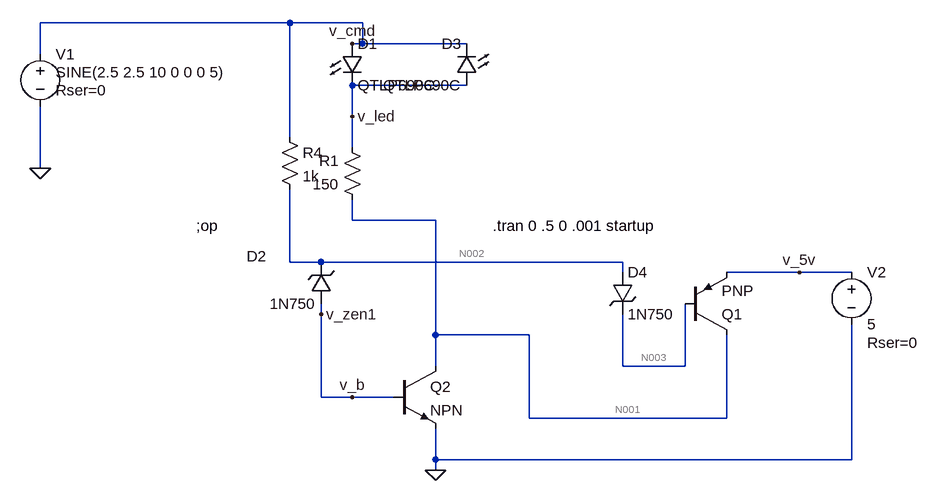
[diagram p0: schematic LedBicolore3Etats1Fil.asc]
LedBicolore3Etats1Fil.asc, the LTspice schematic file:
Version 4
SHEET 1 1060 680
WIRE 80 -32 -304 -32
WIRE 192 -32 80 -32
WIRE 192 0 192 -32
WIRE 192 0 176 0
WIRE 352 0 192 0
WIRE -304 16 -304 -32
WIRE 352 64 176 64
WIRE 176 112 176 64
WIRE 80 144 80 -32
WIRE 176 160 176 112
WIRE -304 192 -304 96
WIRE 176 272 176 240
WIRE 304 272 176 272
WIRE 80 336 80 224
WIRE 128 336 80 336
WIRE 592 336 128 336
WIRE 592 352 592 336
WIRE 864 352 752 352
WIRE 944 352 864 352
WIRE 128 416 128 400
WIRE 304 448 304 272
WIRE 448 448 304 448
WIRE 304 496 304 448
WIRE 592 496 592 416
WIRE 688 496 688 400
WIRE 688 496 592 496
WIRE 128 544 128 416
WIRE 176 544 128 544
WIRE 240 544 176 544
WIRE 448 576 448 448
WIRE 752 576 752 448
WIRE 752 576 448 576
WIRE 304 640 304 592
WIRE 944 640 944 432
WIRE 944 640 304 640
WIRE 304 656 304 640
FLAG 304 656 0
FLAG 176 0 v_cmd
FLAG 128 416 v_zen1
FLAG 176 544 v_b
FLAG -304 192 0
FLAG 176 112 v_led
FLAG 864 352 v_5v
SYMBOL res 192 256 R180
WINDOW 0 36 76 Left 2
WINDOW 3 36 40 Left 2
SYMATTR InstName R1
SYMATTR Value 150
SYMATTR SpiceLine tol=1 pwr=0.1
SYMBOL LED 160 0 R0
SYMATTR InstName D1
SYMATTR Value QTLP690C
SYMBOL voltage -304 0 R0
WINDOW 3 24 44 Left 2
WINDOW 123 0 0 Left 2
WINDOW 39 24 72 Left 2
SYMATTR Value SINE(2.5 2.5 10 0 0 0 5)
SYMATTR SpiceLine Rser=0
SYMATTR InstName V1
SYMBOL npn 240 496 R0
SYMATTR InstName Q2
SYMBOL zener 144 400 R180
WINDOW 0 100 73 Left 2
WINDOW 3 24 0 Left 2
SYMATTR InstName D2
SYMATTR Value 1N750
SYMBOL LED 368 64 R180
WINDOW 0 24 64 Left 2
WINDOW 3 24 0 Left 2
SYMATTR InstName D3
SYMATTR Value QTLP690C
SYMBOL zener 576 352 R0
SYMATTR InstName D4
SYMATTR Value 1N750
SYMBOL pnp 688 448 M180
SYMATTR InstName Q1
SYMBOL voltage 944 336 R0
WINDOW 123 0 0 Left 2
WINDOW 39 24 124 Left 2
SYMATTR SpiceLine Rser=0
SYMATTR InstName V2
SYMATTR Value 5
SYMBOL res 64 128 R0
SYMATTR InstName R4
SYMATTR Value 1k
TEXT -64 280 Left 2 !;op
TEXT 392 280 Left 2 !.tran 0 .5 0 .001 startup

The netlist it stands for:
* LedBicolore3Etats1Fil.asc
R1 N001 v_led 150 tol=1 pwr=0.1
D1 v_cmd v_led QTLP690C
V1 v_cmd 0 SINE(2.5 2.5 10 0 0 0 5) Rser=0
Q2 N001 v_b 0 0 NPN
D2 v_b N002 1N750
D3 v_led v_cmd QTLP690C
D4 N002 N003 1N750
Q1 N001 N003 v_5v 0 PNP
V2 v_5v 0 5 Rser=0
R4 v_cmd N002 1k
.model D D
.lib standard.dio
.model NPN NPN
.model PNP PNP
.lib standard.bjt
;op
.tran 0 .5 0 .001 startup
.backanno
.end

* Results of the author's LTspice run, read from the files saved beside the schematic
* Operating Point, zero values left out:
*   V(n001) = 873.4 mV
*   V(v_led) = 889.2 mV
*   V(v_cmd) = 2.5 V
*   V(v_b) = 716.1 mV
*   V(n002) = 2.499 V
*   V(n003) = 2.5 V
*   Ic(Q1) = -1.627 pA
*   Ib(Q1) = 4.126 pA
*   Ie(Q1) = -2.5 pA
*   Ic(Q2) = 105.7 µA
*   Ib(Q2) = 1.057 µA
*   Ie(Q2) = -106.7 µA
*   I(D4) = 4.128 pA
*   I(D2) = -1.057 µA
*   I(D3) = -1.611 pA
*   I(D1) = 105.7 µA
*   I(R4) = 1.057 µA
*   I(R1) = -105.7 µA
*   I(V2) = 2.5 pA
*   I(V1) = -106.7 µA
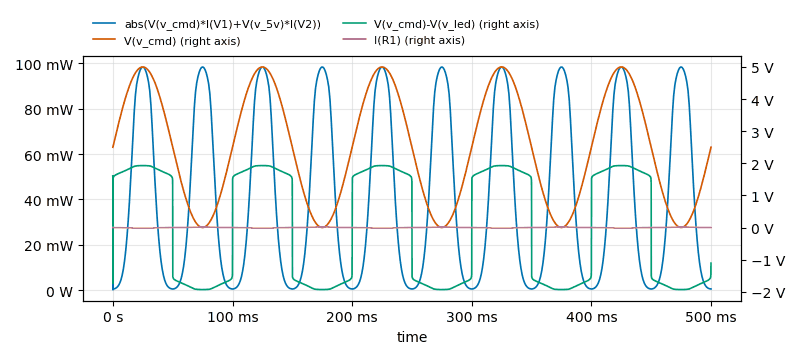
[diagram p1: Transient Analysis of LedBicolore3Etats1Fil.asc, plotted from the saved traces]
* Transient Analysis, 1 run:
*   abs(V(v_cmd)*I(V1)+V(v_5v)*I(V2)): min 266.8 µW, max 98.37 mW, average 41.35 mW, rms 56.24 mW, last 535 µW
*   V(v_cmd): min 2.497 mV, max 4.998 V, average 2.5 V, rms 3.061 V, last 2.5 V
*   V(v_cmd)-V(v_led): min -1.929 V, max 1.929 V, average -86.94 µV, rms 1.8 V, last -1.106 V
*   I(R1): min -19.44 mA, max 19.44 mA, average 397 nA, rms 11.51 mA, last -2.446 µA